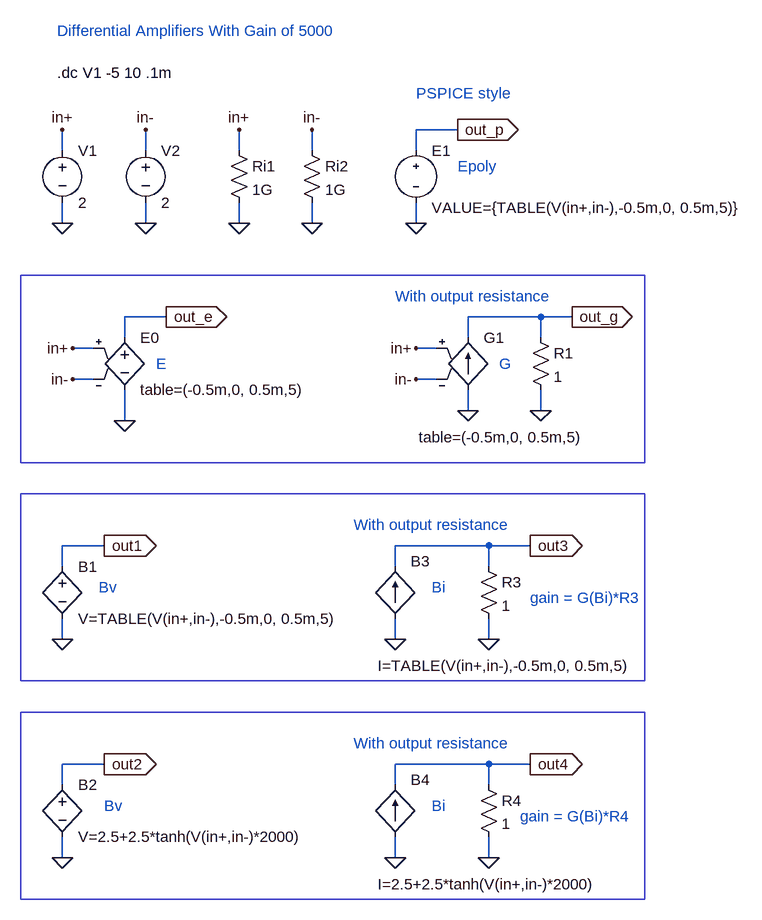
[diagram p0: schematic ideal_amps1.asc]
ideal_amps1.asc, the LTspice schematic file:
Version 4
SHEET 1 1536 1076
WIRE 240 -112 176 -112
WIRE -368 -80 -368 -112
WIRE -240 -80 -240 -112
WIRE -96 -80 -96 -112
WIRE 16 -80 16 -112
WIRE 176 -80 176 -112
WIRE -368 32 -368 0
WIRE -240 32 -240 0
WIRE -96 32 -96 0
WIRE 16 32 16 0
WIRE 176 32 176 0
WIRE -208 176 -272 176
WIRE 368 176 256 176
WIRE 416 176 368 176
WIRE -272 208 -272 176
WIRE 256 208 256 176
WIRE 368 208 368 176
WIRE -320 224 -352 224
WIRE 208 224 176 224
WIRE -320 272 -352 272
WIRE 208 272 176 272
WIRE 256 320 256 288
WIRE 368 320 368 288
WIRE -272 336 -272 288
WIRE -304 528 -368 528
WIRE 288 528 144 528
WIRE 352 528 288 528
WIRE -368 560 -368 528
WIRE 144 560 144 528
WIRE 288 560 288 528
WIRE -368 672 -368 640
WIRE 144 672 144 640
WIRE 288 672 288 640
WIRE -304 864 -368 864
WIRE 288 864 144 864
WIRE 352 864 288 864
WIRE -368 896 -368 864
WIRE 144 896 144 864
WIRE 288 896 288 864
WIRE -368 1008 -368 976
WIRE 144 1008 144 976
WIRE 288 1008 288 976
FLAG 176 32 0
FLAG 240 -112 out_p
IOPIN 240 -112 Out
FLAG -368 32 0
FLAG 16 -112 in-
FLAG -96 -112 in+
FLAG 16 32 0
FLAG -96 32 0
FLAG -240 32 0
FLAG -368 -112 in+
FLAG -240 -112 in-
FLAG -368 672 0
FLAG -304 528 out1
IOPIN -304 528 Out
FLAG -368 1008 0
FLAG -304 864 out2
IOPIN -304 864 Out
FLAG 144 672 0
FLAG 352 528 out3
IOPIN 352 528 Out
FLAG 288 672 0
FLAG 144 1008 0
FLAG 352 864 out4
IOPIN 352 864 Out
FLAG 288 1008 0
FLAG -272 336 0
FLAG -208 176 out_e
IOPIN -208 176 Out
FLAG -352 224 in+
FLAG -352 272 in-
FLAG 256 320 0
FLAG 416 176 out_g
IOPIN 416 176 Out
FLAG 176 224 in+
FLAG 176 272 in-
FLAG 368 320 0
SYMBOL voltage -368 -96 R0
SYMATTR InstName V1
SYMATTR Value 2
SYMBOL Misc\\Epoly 176 -96 R0
SYMATTR InstName E1
SYMATTR Value VALUE={TABLE(V(in+,in-),-0.5m,0, 0.5m,5)}
SYMBOL res -112 -96 R0
SYMATTR InstName Ri1
SYMATTR Value 1G
SYMBOL res 0 -96 R0
SYMATTR InstName Ri2
SYMATTR Value 1G
SYMBOL voltage -240 -96 R0
SYMATTR InstName V2
SYMATTR Value 2
SYMBOL bv -368 544 R0
SYMATTR InstName B1
SYMATTR Value V=TABLE(V(in+,in-),-0.5m,0, 0.5m,5)
SYMBOL bv -368 880 R0
SYMATTR InstName B2
SYMATTR Value V=2.5+2.5*tanh(V(in+,in-)*2000)
SYMBOL bi 144 640 M180
WINDOW 0 24 88 Left 0
WINDOW 3 -27 -73 Left 0
SYMATTR InstName B3
SYMATTR Value I=TABLE(V(in+,in-),-0.5m,0, 0.5m,5)
SYMBOL res 272 544 R0
SYMATTR InstName R3
SYMATTR Value 1
SYMBOL bi 144 976 M180
WINDOW 0 24 88 Left 0
WINDOW 3 -27 -73 Left 0
SYMATTR InstName B4
SYMATTR Value I=2.5+2.5*tanh(V(in+,in-)*2000)
SYMBOL res 272 880 R0
SYMATTR InstName R4
SYMATTR Value 1
SYMBOL e -272 192 R0
SYMATTR InstName E0
SYMATTR Value table=(-0.5m,0, 0.5m,5)
SYMBOL g 256 192 R0
WINDOW 3 -76 169 Left 0
SYMATTR InstName G1
SYMATTR Value table=(-0.5m,0, 0.5m,5)
SYMBOL res 352 192 R0
SYMATTR InstName R1
SYMATTR Value 1
TEXT -376 -200 Left 0 !.dc V1 -5 10 .1m
TEXT -376 -264 Left 0 ;Differential Amplifiers With Gain of 5000
TEXT 240 -56 Left 0 ;Epoly
TEXT -304 928 Left 0 ;Bv
TEXT -312 592 Left 0 ;Bv
TEXT 200 592 Left 0 ;Bi
TEXT 80 496 Left 0 ;With output resistance
TEXT 352 608 Left 0 ;gain = G(Bi)*R3
TEXT 200 928 Left 0 ;Bi
TEXT 80 832 Left 0 ;With output resistance
TEXT 336 944 Left 0 ;gain = G(Bi)*R4
TEXT 176 -168 Left 0 ;PSPICE style
TEXT -224 248 Left 0 ;E
TEXT 304 248 Left 0 ;G
TEXT 144 144 Left 0 ;With output resistance
RECTANGLE Normal 528 400 -432 112
RECTANGLE Normal 528 736 -432 448
RECTANGLE Normal 528 1072 -432 784

The netlist it stands for:
* ideal_amps1.asc
V1 in+ 0 2
E1 out_p 0 VALUE={TABLE(V(in+,in-),-0.5m,0, 0.5m,5)}
Ri1 in+ 0 1G
Ri2 in- 0 1G
V2 in- 0 2
B1 out1 0 V=TABLE(V(in+,in-),-0.5m,0, 0.5m,5)
B2 out2 0 V=2.5+2.5*tanh(V(in+,in-)*2000)
B3 0 out3 I=TABLE(V(in+,in-),-0.5m,0, 0.5m,5)
R3 out3 0 1
B4 0 out4 I=2.5+2.5*tanh(V(in+,in-)*2000)
R4 out4 0 1
E0 out_e 0 in+ in- table=(-0.5m,0, 0.5m,5)
G1 0 out_g in+ in- table=(-0.5m,0, 0.5m,5)
R1 out_g 0 1
.dc V1 -5 10 .1m
* Differential Amplifiers With Gain of 5000
* Epoly
* Bv
* Bv
* Bi
* With output resistance
* gain = G(Bi)*R3
* Bi
* With output resistance
* gain = G(Bi)*R4
* PSPICE style
* E
* G
* With output resistance
.backanno
.end